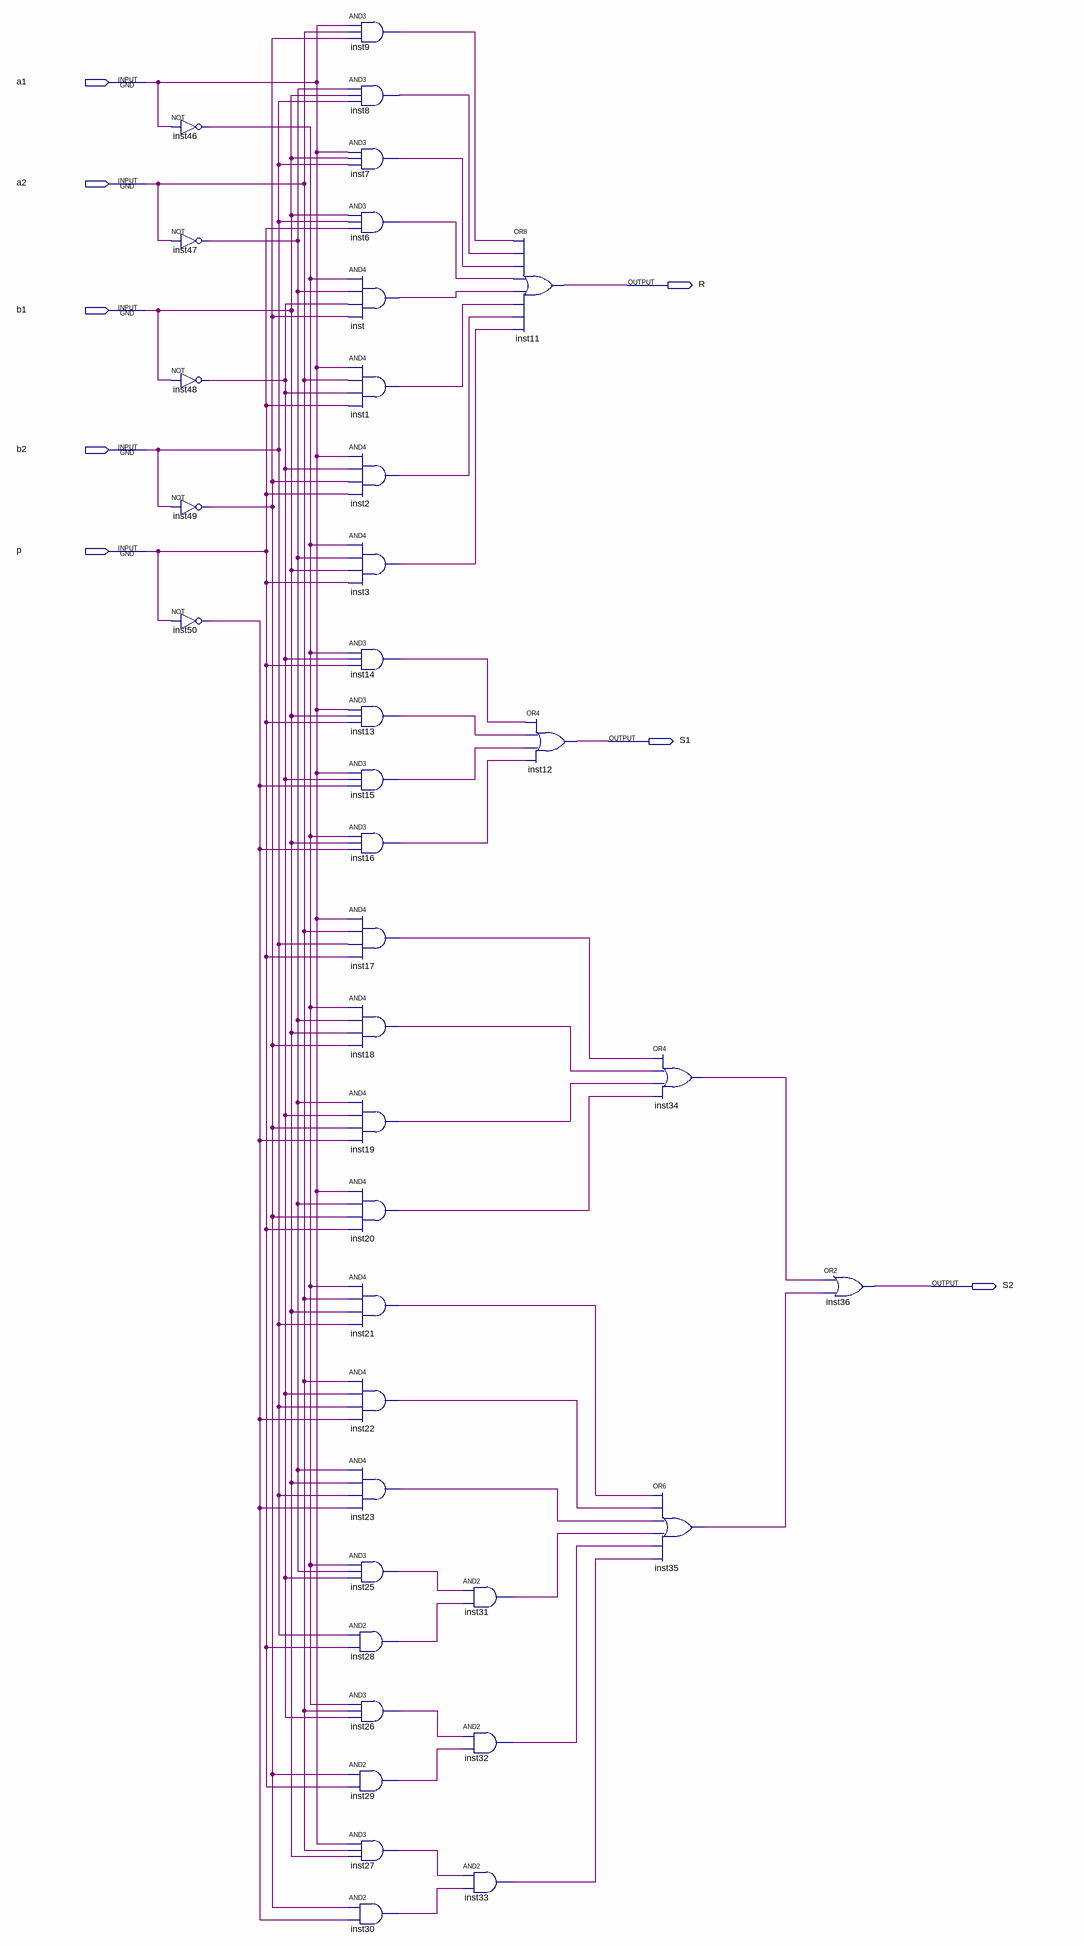
[diagram p0: schematic sheet]
// Quartus schematic OCHS.bdf as structural Verilog: 38 symbols, 8 pins
module OCHS (
  input  a1,
  input  a2,
  input  b1,
  input  b2,
  input  p,
  output R,
  output S1,
  output S2
);

  wire inst1_out, inst2_out, inst3_out, inst6_out, inst7_out, inst8_out, inst9_out, inst13_out, inst14_out,
       inst15_out, inst16_out, inst17_out, inst18_out, inst19_out, inst20_out, inst21_out, inst22_out,
       inst23_out, inst25_out, inst26_out, inst27_out, inst28_out, inst29_out, inst30_out, inst31_out,
       inst32_out, inst33_out, inst34_out, inst35_out, inst46_out, inst47_out, inst48_out, inst49_out,
       inst50_out, inst_out;

  not inst46 (inst46_out, a1);
  not inst47 (inst47_out, a2);
  not inst48 (inst48_out, b1);
  not inst49 (inst49_out, b2);
  not inst50 (inst50_out, p);
  and inst9 (inst9_out, a1, a2, inst49_out);
  and inst8 (inst8_out, inst47_out, b1, b2);
  and inst7 (inst7_out, a1, b1, b2);
  and inst6 (inst6_out, b1, b2, p);
  and inst (inst_out, inst46_out, inst47_out, inst48_out, inst49_out);
  and inst1 (inst1_out, a1, a2, inst48_out, p);
  and inst2 (inst2_out, a1, inst48_out, inst49_out, p);
  and inst3 (inst3_out, inst46_out, inst47_out, b1, p);
  and inst14 (inst14_out, inst46_out, inst48_out, p);
  and inst13 (inst13_out, a1, b1, p);
  and inst15 (inst15_out, a1, inst48_out, inst50_out);
  and inst16 (inst16_out, inst46_out, b1, inst50_out);
  and inst17 (inst17_out, a1, a2, b2, p);
  and inst18 (inst18_out, inst46_out, inst47_out, b1, inst49_out);
  and inst19 (inst19_out, inst47_out, inst48_out, inst49_out, inst50_out);
  and inst20 (inst20_out, a1, inst47_out, inst49_out, p);
  and inst21 (inst21_out, inst46_out, a2, b1, b2);
  and inst22 (inst22_out, a2, inst48_out, b2, inst50_out);
  and inst23 (inst23_out, inst47_out, b1, b2, inst50_out);
  and inst25 (inst25_out, inst46_out, inst47_out, inst48_out);
  and inst28 (inst28_out, b2, p);
  and inst26 (inst26_out, inst46_out, a2, inst48_out);
  and inst29 (inst29_out, inst49_out, p);
  and inst27 (inst27_out, a1, a2, b1);
  and inst30 (inst30_out, inst49_out, inst50_out);
  and inst31 (inst31_out, inst25_out, inst28_out);
  and inst32 (inst32_out, inst26_out, inst29_out);
  and inst33 (inst33_out, inst27_out, inst30_out);
  or inst11 (R, inst9_out, inst8_out, inst7_out, inst6_out, inst_out, inst1_out, inst2_out, inst3_out);
  or inst12 (S1, inst14_out, inst13_out, inst15_out, inst16_out);
  or inst34 (inst34_out, inst17_out, inst18_out, inst19_out, inst20_out);
  or inst35 (inst35_out, inst21_out, inst22_out, inst23_out, inst31_out, inst32_out, inst33_out);
  or inst36 (S2, inst34_out, inst35_out);
endmodule
